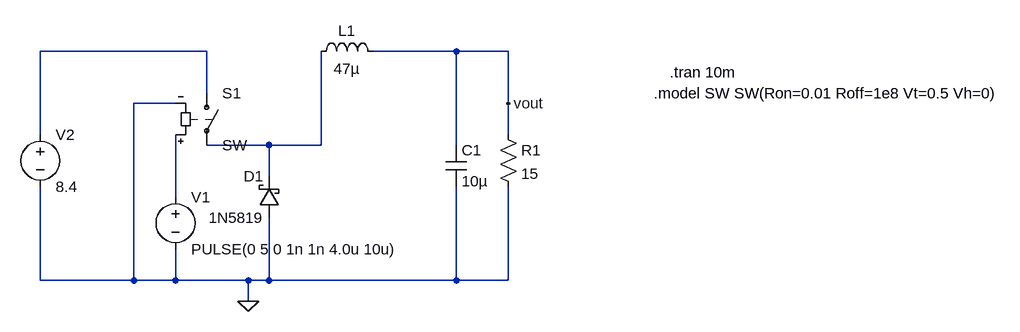
[diagram p0: schematic Nomor _1dan3_sementara.asc]
Nomor _1dan3_sementara.asc, the LTspice schematic file:
Version 4
SHEET 1 1332 680
WIRE 64 -64 -192 -64
WIRE 448 -64 320 -64
WIRE 528 -64 448 -64
WIRE 64 0 64 -64
WIRE 16 16 -48 16
WIRE 528 16 528 -64
WIRE -192 64 -192 -64
WIRE 528 64 528 16
WIRE 160 80 64 80
WIRE 240 80 240 -64
WIRE 240 80 160 80
WIRE 448 80 448 -64
WIRE 160 128 160 80
WIRE 16 160 16 64
WIRE -192 288 -192 144
WIRE -48 288 -48 16
WIRE -48 288 -192 288
WIRE 16 288 16 240
WIRE 16 288 -48 288
WIRE 128 288 16 288
WIRE 160 288 160 192
WIRE 160 288 128 288
WIRE 448 288 448 144
WIRE 448 288 160 288
WIRE 528 288 528 144
WIRE 528 288 448 288
WIRE 128 320 128 288
FLAG 128 320 0
FLAG 528 16 vout
SYMBOL cap 432 80 R0
SYMATTR InstName C1
SYMATTR Value 10µ
SYMBOL voltage 16 144 R0
WINDOW 123 0 0 Left 0
WINDOW 39 0 0 Left 0
SYMATTR InstName V1
SYMATTR Value PULSE(0 5 0 1n 1n 4.0u 10u)
SYMBOL schottky 176 192 R180
WINDOW 0 24 64 Left 2
WINDOW 3 24 0 Left 2
SYMATTR InstName D1
SYMATTR Value 1N5819
SYMATTR Description Diode
SYMATTR Type diode
SYMBOL voltage -192 48 R0
WINDOW 123 0 0 Left 0
WINDOW 39 0 0 Left 0
SYMATTR InstName V2
SYMATTR Value 8.4
SYMBOL ind 224 -48 R270
WINDOW 0 32 56 VTop 2
WINDOW 3 5 56 VBottom 2
SYMATTR InstName L1
SYMATTR Value 47µ
SYMBOL res 512 48 R0
SYMATTR InstName R1
SYMATTR Value 15
SYMBOL sw 64 -16 R0
SYMATTR InstName S1
TEXT 776 -32 Left 2 !.tran 10m
TEXT 752 0 Left 2 !.model SW SW(Ron=0.01 Roff=1e8 Vt=0.5 Vh=0)

The netlist it stands for:
* Nomor _1dan3_sementara.asc
C1 vout 0 10µ
V1 N003 0 PULSE(0 5 0 1n 1n 4.0u 10u)
D1 0 N002 1N5819
V2 N001 0 8.4
L1 N002 vout 47µ
R1 vout 0 15
S1 N001 N002 N003 0 SW
.model D D
.lib standard.dio
.tran 10m
.model SW SW(Ron=0.01 Roff=1e8 Vt=0.5 Vh=0)
.backanno
.end